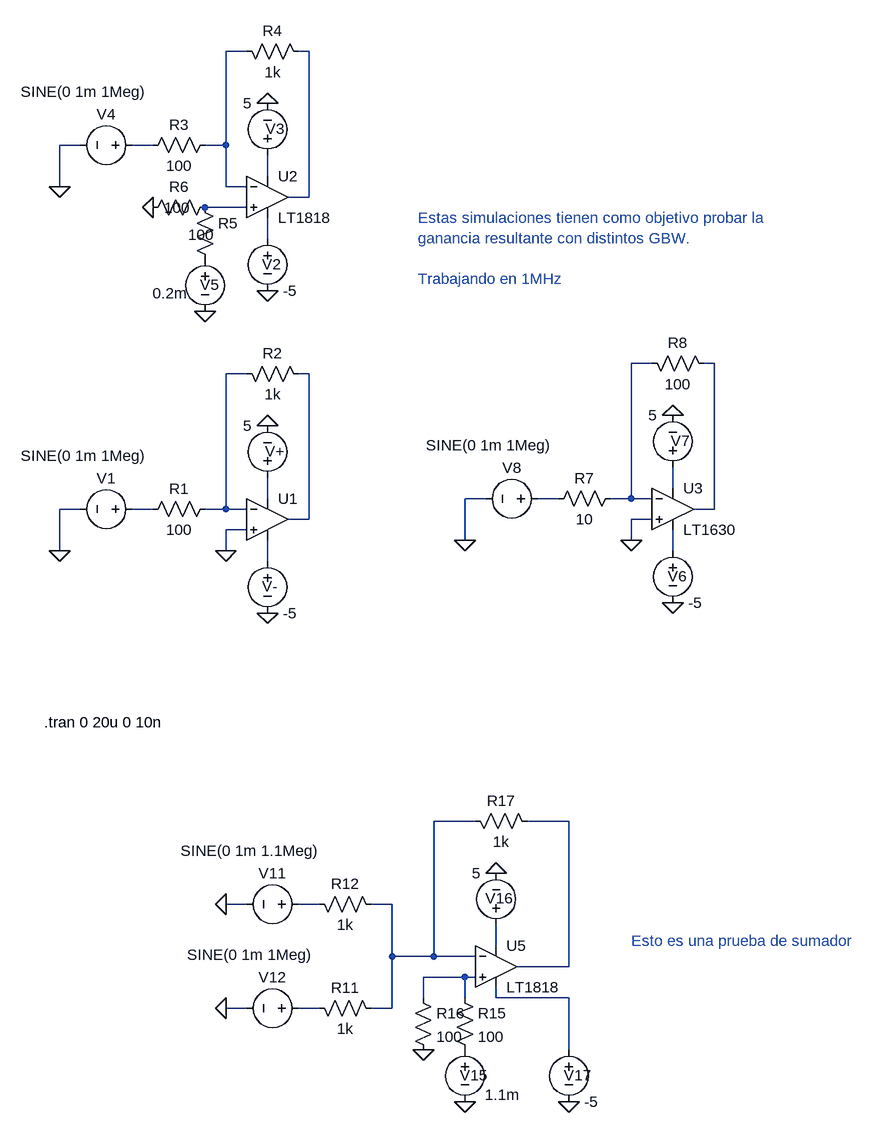
[diagram p0: schematic Sim_TestGBW.asc]
Sim_TestGBW.asc, the LTspice schematic file:
Version 4.1
SHEET 1 936 1796
WIRE -192 -256 -224 -256
WIRE -96 -256 -112 -256
WIRE -448 -112 -480 -112
WIRE -336 -112 -368 -112
WIRE -224 -112 -224 -256
WIRE -224 -112 -256 -112
WIRE -160 -64 -160 -96
WIRE -480 -48 -480 -112
WIRE -224 -48 -224 -112
WIRE -192 -48 -224 -48
WIRE -96 -32 -96 -256
WIRE -96 -32 -128 -32
WIRE -192 -16 -256 -16
WIRE -160 32 -160 0
WIRE 432 224 400 224
WIRE 528 224 512 224
WIRE -192 240 -224 240
WIRE -96 240 -112 240
WIRE 464 416 464 384
WIRE -160 432 -160 400
WIRE 176 432 144 432
WIRE 288 432 256 432
WIRE 400 432 400 224
WIRE 400 432 368 432
WIRE 432 432 400 432
WIRE -448 448 -480 448
WIRE -336 448 -368 448
WIRE -224 448 -224 240
WIRE -224 448 -256 448
WIRE -192 448 -224 448
WIRE 528 448 528 224
WIRE 528 448 496 448
WIRE -96 464 -96 240
WIRE -96 464 -128 464
WIRE 432 464 400 464
WIRE -192 480 -224 480
WIRE 144 496 144 432
WIRE 400 496 400 464
WIRE -480 512 -480 448
WIRE -224 512 -224 480
WIRE 464 512 464 480
WIRE -160 528 -160 496
WIRE 160 928 96 928
WIRE 304 928 240 928
WIRE -192 1056 -224 1056
WIRE -80 1056 -112 1056
WIRE 32 1056 0 1056
WIRE 192 1120 192 1088
WIRE 32 1136 32 1056
WIRE 96 1136 96 928
WIRE 96 1136 32 1136
WIRE 160 1136 96 1136
WIRE 304 1152 304 928
WIRE 304 1152 224 1152
WIRE 144 1168 80 1168
WIRE 160 1168 144 1168
WIRE 80 1200 80 1168
WIRE 144 1200 144 1168
WIRE 192 1200 192 1184
WIRE 304 1200 192 1200
WIRE -192 1216 -224 1216
WIRE -80 1216 -112 1216
WIRE 32 1216 32 1136
WIRE 32 1216 0 1216
WIRE 304 1280 304 1200
FLAG -160 608 0
FLAG -160 320 0
FLAG -480 512 0
FLAG -224 512 0
FLAG -160 112 0
FLAG -160 -176 0
FLAG -480 -48 0
FLAG -336 -16 0
FLAG -256 144 0
FLAG 464 592 0
FLAG 464 304 0
FLAG 144 496 0
FLAG 400 496 0
FLAG -224 1056 0
FLAG -224 1216 0
FLAG 80 1280 0
FLAG 144 1360 0
FLAG 192 1008 0
FLAG 304 1360 0
SYMBOL voltage -160 512 R0
WINDOW 123 0 0 Left 0
WINDOW 39 0 0 Left 0
WINDOW 0 -8 55 Left 2
SYMATTR InstName V-
SYMATTR Value -5
SYMBOL voltage -160 416 R180
WINDOW 123 0 0 Left 0
WINDOW 39 0 0 Left 0
WINDOW 0 -26 57 Left 2
SYMATTR InstName V+
SYMATTR Value 5
SYMBOL OpAmps\\UniversalOpAmp2 -160 464 R0
SYMATTR InstName U1
SYMATTR Value2 Avol=1Meg GBW=50Meg Slew=10Meg
SYMBOL voltage -352 448 R90
WINDOW 0 -32 56 VBottom 2
WINDOW 3 -98 91 VTop 2
WINDOW 123 0 0 Left 0
WINDOW 39 0 0 Left 0
SYMATTR InstName V1
SYMATTR Value SINE(0 1m 1Meg)
SYMBOL res -240 432 R90
WINDOW 0 0 56 VBottom 2
WINDOW 3 32 56 VTop 2
SYMATTR InstName R1
SYMATTR Value 100
SYMBOL res -208 224 M90
WINDOW 0 0 56 VBottom 2
WINDOW 3 32 56 VTop 2
SYMATTR InstName R2
SYMATTR Value 1k
SYMBOL OpAmps\\LT1818 -160 -32 R0
SYMATTR InstName U2
SYMBOL voltage -160 16 R0
WINDOW 123 0 0 Left 0
WINDOW 39 0 0 Left 0
WINDOW 0 -8 55 Left 2
SYMATTR InstName V2
SYMATTR Value -5
SYMBOL voltage -160 -80 R180
WINDOW 123 0 0 Left 0
WINDOW 39 0 0 Left 0
WINDOW 0 -26 57 Left 2
SYMATTR InstName V3
SYMATTR Value 5
SYMBOL voltage -352 -112 R90
WINDOW 0 -32 56 VBottom 2
WINDOW 3 -98 91 VTop 2
WINDOW 123 0 0 Left 0
WINDOW 39 0 0 Left 0
SYMATTR InstName V4
SYMATTR Value SINE(0 1m 1Meg)
SYMBOL res -240 -128 R90
WINDOW 0 0 56 VBottom 2
WINDOW 3 32 56 VTop 2
SYMATTR InstName R3
SYMATTR Value 100
SYMBOL res -208 -272 M90
WINDOW 0 0 56 VBottom 2
WINDOW 3 32 56 VTop 2
SYMATTR InstName R4
SYMATTR Value 1k
SYMBOL res -272 -32 R0
WINDOW 3 -10 58 Left 2
SYMATTR Value 100
SYMATTR InstName R5
SYMBOL res -240 -32 R90
WINDOW 0 0 56 VBottom 2
WINDOW 3 1 59 VTop 2
SYMATTR InstName R6
SYMATTR Value 100
SYMBOL voltage -256 48 R0
WINDOW 123 0 0 Left 0
WINDOW 39 0 0 Left 0
WINDOW 0 -8 55 Left 2
WINDOW 3 -81 68 Left 2
SYMATTR InstName V5
SYMATTR Value 0.2m
SYMBOL OpAmps\\LT1630 464 384 R0
SYMATTR InstName U3
SYMBOL voltage 464 496 R0
WINDOW 123 0 0 Left 0
WINDOW 39 0 0 Left 0
WINDOW 0 -8 55 Left 2
SYMATTR InstName V6
SYMATTR Value -5
SYMBOL voltage 464 400 R180
WINDOW 123 0 0 Left 0
WINDOW 39 0 0 Left 0
WINDOW 0 -26 57 Left 2
SYMATTR InstName V7
SYMATTR Value 5
SYMBOL voltage 272 432 R90
WINDOW 0 -32 56 VBottom 2
WINDOW 3 -98 91 VTop 2
WINDOW 123 0 0 Left 0
WINDOW 39 0 0 Left 0
SYMATTR InstName V8
SYMATTR Value SINE(0 1m 1Meg)
SYMBOL res 384 416 R90
WINDOW 0 0 56 VBottom 2
WINDOW 3 32 56 VTop 2
SYMATTR InstName R7
SYMATTR Value 10
SYMBOL res 416 208 M90
WINDOW 0 0 56 VBottom 2
WINDOW 3 32 56 VTop 2
SYMATTR InstName R8
SYMATTR Value 100
SYMBOL voltage -96 1056 R90
WINDOW 0 -32 56 VBottom 2
WINDOW 3 -98 91 VTop 2
WINDOW 123 0 0 Left 0
WINDOW 39 0 0 Left 0
SYMATTR InstName V11
SYMATTR Value SINE(0 1m 1.1Meg)
SYMBOL voltage -96 1216 R90
WINDOW 0 -32 56 VBottom 2
WINDOW 3 -98 91 VTop 2
WINDOW 123 0 0 Left 0
WINDOW 39 0 0 Left 0
SYMATTR InstName V12
SYMATTR Value SINE(0 1m 1Meg)
SYMBOL res -96 1200 M90
WINDOW 0 0 56 VBottom 2
WINDOW 3 32 56 VTop 2
SYMATTR InstName R11
SYMATTR Value 1k
SYMBOL res -96 1040 M90
WINDOW 0 0 56 VBottom 2
WINDOW 3 32 56 VTop 2
SYMATTR InstName R12
SYMATTR Value 1k
SYMBOL OpAmps\\LT1818 192 1152 R0
SYMATTR InstName U5
SYMBOL res 128 1184 R0
SYMATTR InstName R15
SYMATTR Value 100
SYMBOL res 64 1184 R0
SYMATTR InstName R16
SYMATTR Value 100
SYMBOL voltage 144 1264 R0
WINDOW 123 0 0 Left 0
WINDOW 39 0 0 Left 0
WINDOW 0 -8 55 Left 2
WINDOW 3 31 85 Left 2
SYMATTR InstName V15
SYMATTR Value 1.1m
SYMBOL res 144 912 M90
WINDOW 0 0 56 VBottom 2
WINDOW 3 32 56 VTop 2
SYMATTR InstName R17
SYMATTR Value 1k
SYMBOL voltage 192 1104 R180
WINDOW 123 0 0 Left 0
WINDOW 39 0 0 Left 0
WINDOW 0 -26 57 Left 2
SYMATTR InstName V16
SYMATTR Value 5
SYMBOL voltage 304 1264 R0
WINDOW 123 0 0 Left 0
WINDOW 39 0 0 Left 0
WINDOW 0 -8 55 Left 2
SYMATTR InstName V17
SYMATTR Value -5
TEXT -504 776 Left 2 !.tran 0 20u 0 10n
TEXT 400 1112 Left 2 ;Esto es una prueba de sumador
TEXT 72 0 Left 2 ;Estas simulaciones tienen como objetivo probar la\nganancia resultante con distintos GBW.\n \nTrabajando en 1MHz

The netlist it stands for:
* Sim_TestGBW.asc
V- N016 0 -5
V+ N012 0 5
X§U1 0 N009 N012 N016 N010 level2 Avol=1Meg GBW=50Meg Slew=10Meg Ilimit=25m Rail=0 Vos=0 En=0 Enk=0 In=0 Ink=0 Rin=500Meg  ; pins In+ In- V+ V- OUT
V1 N014 0 SINE(0 1m 1Meg)
R1 N009 N014 100
R2 N009 N010 1k
X§U2 N005 N001 N002 N004 N006 LT1818  ; pins In+ In- OUT V+ V-
V2 N006 0 -5
V3 N004 0 5
V4 N003 0 SINE(0 1m 1Meg)
R3 N001 N003 100
R4 N001 N002 1k
R5 N005 P001 100
R6 N005 0 100
V5 P001 0 0.2m
X§U3 0 N007 N011 N015 N008 LT1630  ; pins In+ In- V+ V- OUT
V6 N015 0 -5
V7 N011 0 5
V8 N013 0 SINE(0 1m 1Meg)
R7 N007 N013 10
R8 N007 N008 100
V11 N019 0 SINE(0 1m 1.1Meg)
V12 N023 0 SINE(0 1m 1Meg)
R11 N023 N017 1k
R12 N019 N017 1k
X§U5 N021 N017 N018 N020 N022 LT1818  ; pins In+ In- OUT V+ V-
R15 N021 P002 100
R16 N021 0 100
V15 P002 0 1.1m
R17 N017 N018 1k
V16 N020 0 5
V17 N022 0 -5
.tran 0 20u 0 10n
* Esto es una prueba de sumador
* Estas simulaciones tienen como objetivo probar la
* ganancia resultante con distintos GBW.
* Trabajando en 1MHz
.lib UniversalOpAmp2.lib
.lib LTC2.lib
.backanno
.end